# Altium schematic sheet Sheet2.SchDoc
size B; SheetNumber: 1; SheetTotal: 1
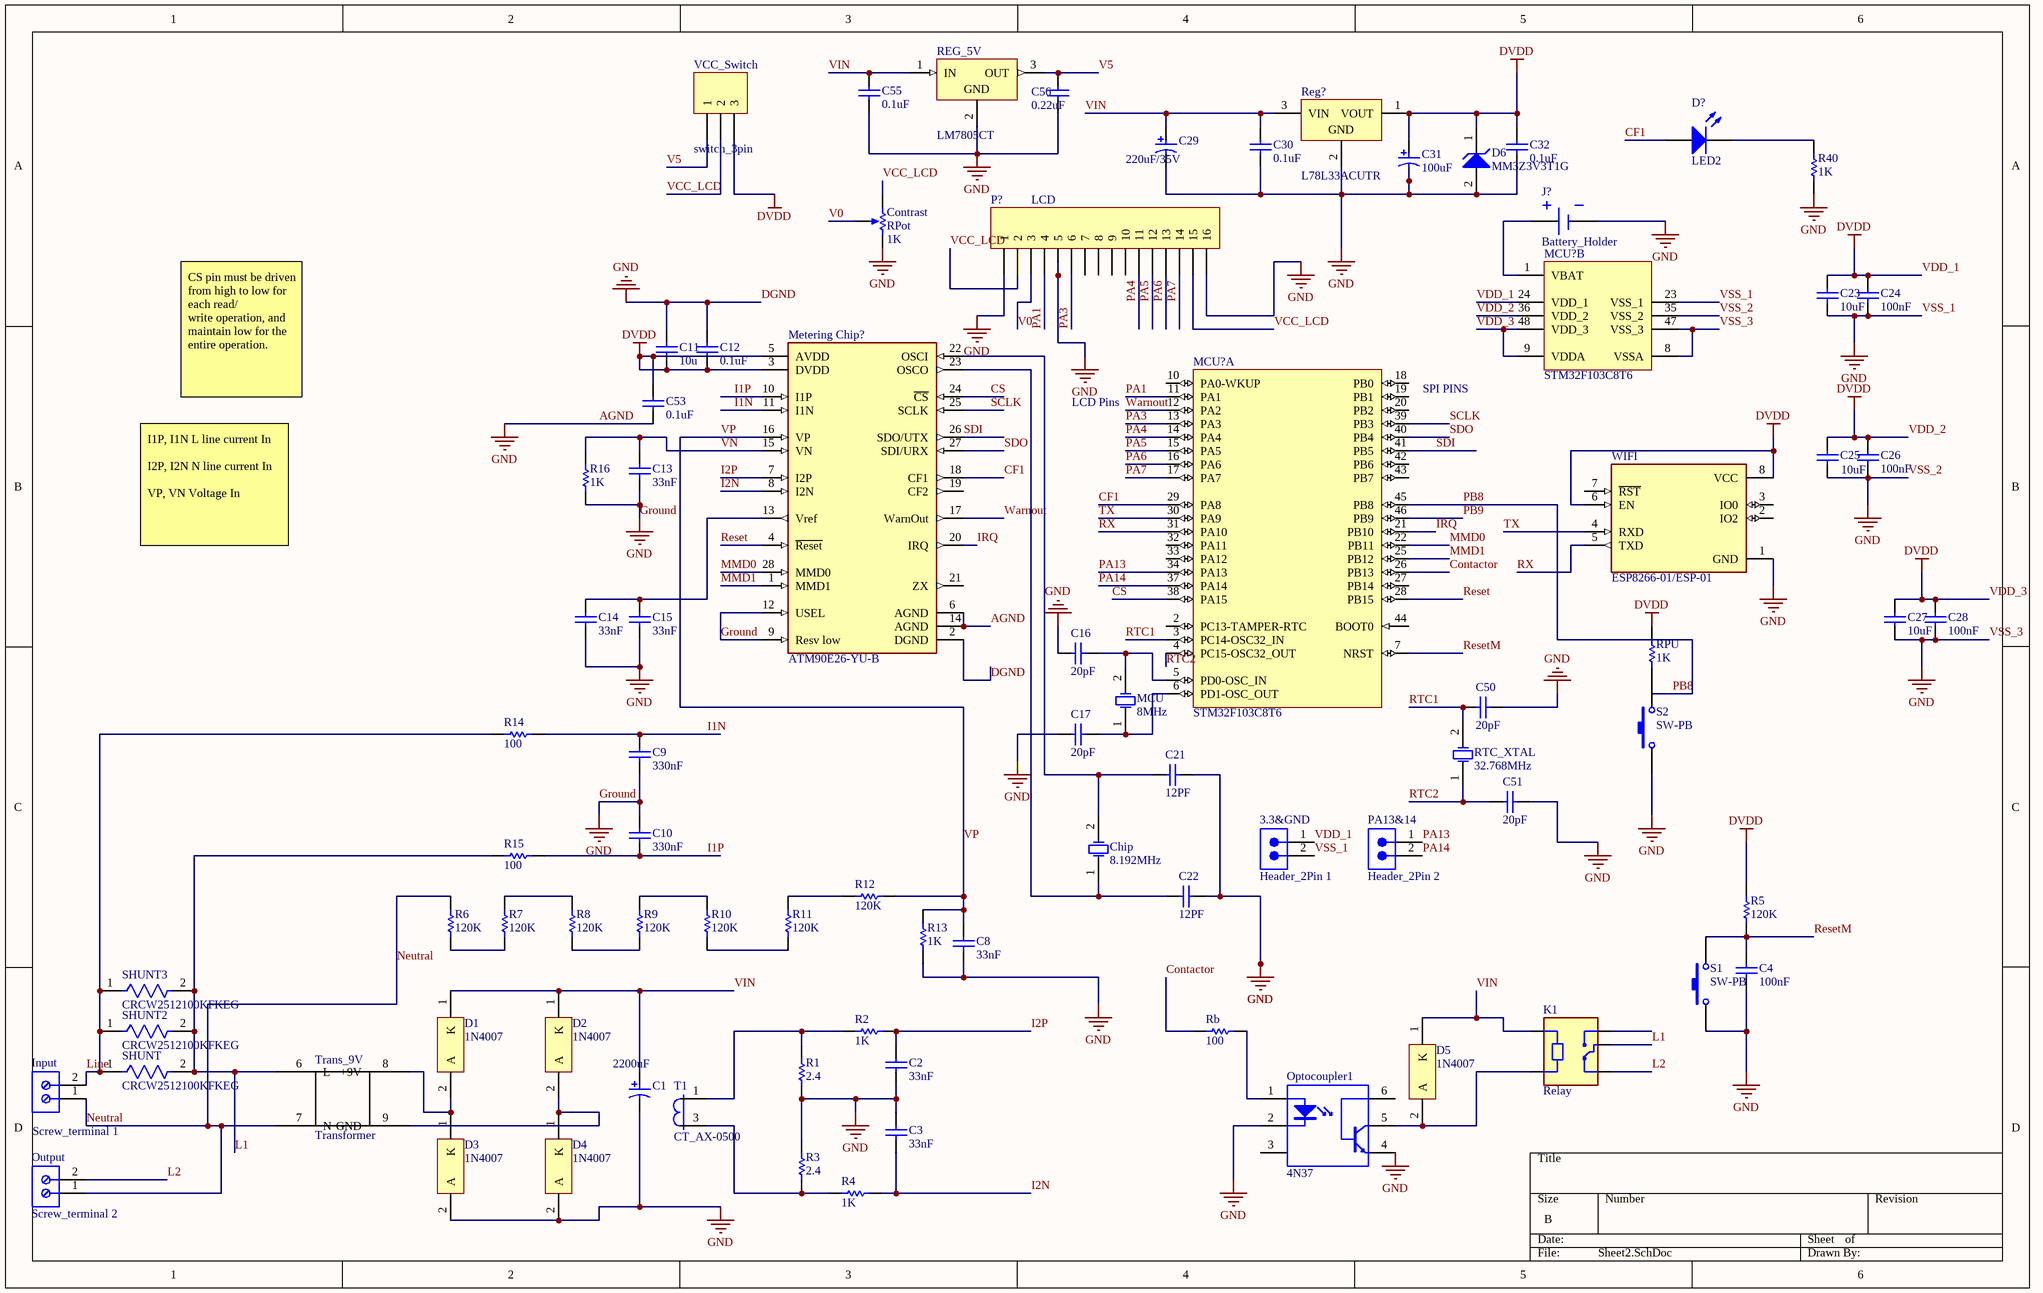
[diagram p0: Sheet2.SchDoc]

## Parts
(Parts that share a designator on the sheet are numbered #1, #2 ... from top to bottom, then left to right.)
3.3&GND  Header_2Pin 1  [SMTC-TSW-102-08-X-S-RA]
C1  2200uF  [PNSC-EEV-FK1J471M_L]
C2  33nF  [CAPC2013X94X50ML20T25]
C3  33nF  [CAPC2013X94X50ML20T25]
C4  100nF  [CAPC2013X94X50ML20T25]
C8  33nF  [CAPC2013X94X50ML20T25]
C9  330nF  [CAPC2013X94X50ML20T25]
C10  330nF  [CAPC2013X94X50ML20T25]
C11  10u  [CAPC2013X94X50ML20T25]
C12  0.1uF  [CAPC2013X94X50ML20T25]
C13  33nF  [CAPC2013X94X50ML20T25]
C14  33nF  [CAPC2013X94X50ML20T25]
C15  33nF  [CAPC2013X94X50ML20T25]
C16  20pF  [CAPC2013X94X50ML20T25]
C17  20pF  [CAPC2013X94X50ML20T25]
C21  12PF  [CAPC2013X94X50ML20T25]
C22  12PF  [CAPC2013X94X50ML20T25]
C23  10uF  [CAPC2013X94X50ML20T25]
C24  100nF  [CAPC2013X94X50ML20T25]
C25  10uF  [CAPC2013X94X50ML20T25]
C26  100nF  [CAPC2013X94X50ML20T25]
C27  10uF  [CAPC2013X94X50ML20T25]
C28  100nF  [CAPC2013X94X50ML20T25]
C29  220uF/35V  [PNSC-EEE-TG1V221UP_L]
C30  0.1uF  [CAPC2013X94X50ML20T25]
C31  100uF  [PNSC-EEE-TG1V221UP_L]
C32  0.1uF  [CAPC2013X94X50ML20T25]
C50  20pF  [CAPC2013X94X50ML20T25]
C51  20pF  [CAPC2013X94X50ML20T25]
C53  0.1uF  [CAPC2013X94X50ML20T25]
C55  0.1uF  [CAPC2013X94X50ML20T25]
C56  0.22uF  [CAPC2013X94X50ML20T25]
Chip  8.192MHz  [R38]
Contrast  RPot  value 1K  [VR5]
D1  1N4007  [ONSC-AXIAL_LEAD-2-59-10_P]
D2  1N4007  [ONSC-AXIAL_LEAD-2-59-10_P]
D3  1N4007  [ONSC-AXIAL_LEAD-2-59-10_P]
D4  1N4007  [ONSC-AXIAL_LEAD-2-59-10_P]
D5  1N4007  [ONSC-AXIAL_LEAD-2-59-10_P]
D6  MM3Z3V3T1G  [ONSC-SOD-323-2-477-02_V]
D?  LED2  [3.2X1.6X1.1]
Input  Screw_terminal 1  [PHOE-1714955_V]
J?  Battery_Holder  [KEYSTONE-1025-7-2_V]
K1  Relay  [RELAY_SRD-05VDC-SL-C]
MCU  8MHz  [R38]
MCU?#1  STM32F103C8T6  [STM-LQFP48_L]  (part B of 2)
MCU?#2  STM32F103C8T6  [STM-LQFP48_L]  (part A of 2)
Metering_Chip?  ATM90E26-YU-B  [FP-28Y-IPC_C]
Optocoupler1  4N37  [LTST-DIP-6_A]
Output  Screw_terminal 2  [PHOE-1714955_V]
P?  LCD  [HDR1X16]
PA13&14  Header_2Pin 2  [SMTC-TSW-102-08-X-S-RA]
R1  2.4  [RESC2013X50X30ML20T20]
R2  1K  [RESC2013X50X30ML20T20]
R3  2.4  [RESC2013X50X30ML20T20]
R4  1K  [RESC2013X50X30ML20T20]
R5  120K  [RESC2013X50X30ML20T20]
R6  120K  [RESC2013X50X30ML20T20]
R7  120K  [RESC2013X50X30ML20T20]
R8  120K  [RESC2013X50X30ML20T20]
R9  120K  [RESC2013X50X30ML20T20]
R10  120K  [RESC2013X50X30ML20T20]
R11  120K  [RESC2013X50X30ML20T20]
R12  120K  [RESC2013X50X30ML20T20]
R13  1K  [RESC2013X50X30ML20T20]
R14  100  [RESC2013X50X30ML20T20]
R15  100  [RESC2013X50X30ML20T20]
R16  1K  [RESC2013X50X30ML20T20]
R40  1K  [RESC2013X50X30ML20T20]
Rb  100  [RESC2013X50X30ML20T20]
Reg?  L78L33ACUTR  [SOT-89_L]
REG_5V  LM7805CT  [FAIR-TO-220-3]
RPU  1K  [RESC2013X50X30ML20T20]
RTC_XTAL  32.768MHz  [R38]
S1  SW-PB  [SPST-2]
S2  SW-PB  [SPST-2]
SHUNT  CRCW2512100KFKEG  [FP-CRCW2512-e3-MFG]
SHUNT2  CRCW2512100KFKEG  [FP-CRCW2512-e3-MFG]
SHUNT3  CRCW2512100KFKEG  [FP-CRCW2512-e3-MFG]
T1  CT_AX-0500  [INDRR1270W55L1720T953H2040_AX-0500]
Trans_9V  Transformer  [PCBComponent_1]
VCC_Switch  switch_3pin  [HDR1X3H]
WIFI  ESP8266-01/ESP-01  [XCVR_ESP8266-01/ESP-01]

## Nets
AGND: 3.3&GND.2 C1.2 C2.2 C3.1 C4.2 C8.2 C9.2 C10.1 C11.1 C12.1 C13.2 C14.2 C15.2 C16.1 C17.2 C21.1 C22.1 C23.2 C24.2 C25.2 C26.2 C27.2 C28.2 C29.2 C30.1 C31.2 C32.1 C50.2 C51.2 C53.2 C55.1 C56.1 Contrast.2(BOT) D3.2(A) D4.2(A) D6.2(A) J?.2(-) MCU?#1.8(VSSA) MCU?#1.23(VSS_1) MCU?#1.35(VSS_2) MCU?#1.47(VSS_3) Metering_Chip?.2(DGND) Metering_Chip?.6(AGND) Metering_Chip?.9(Resv_low) Metering_Chip?.12(USEL) Metering_Chip?.14(AGND) Optocoupler1.2(C) Optocoupler1.4(E) P?.1 P?.5 P?.16 R1.1 R3.2 R13.1 R16.1 R40.1 Reg?.2(GND) REG_5V.2(GND) S1.1 S2.1 WIFI.1(GND)  [also labelled DGND, GND, Ground, VSS_1, VSS_2, VSS_3]
VDD_1: 3.3&GND.1 C11.2 C12.2 C23.1 C24.1 C25.1 C26.1 C27.1 C28.1 C31.1 C32.2 C53.1 D6.1(K) MCU?#1.9(VDDA) MCU?#1.24(VDD_1) MCU?#1.36(VDD_2) MCU?#1.48(VDD_3) Metering_Chip?.3(DVDD) Metering_Chip?.5(AVDD) R5.2 Reg?.1(VOUT) RPU.2 VCC_Switch.3 WIFI.6(EN) WIFI.8(VCC)  [also labelled DVDD, VDD_2, VDD_3]
CF1: D?.1(A) MCU?#2.29(PA8) Metering_Chip?.18(CF1)
Contactor: MCU?#2.26(PB13) Rb.2
CS: MCU?#2.38(PA15) Metering_Chip?.24(~{CS})
I1N: C9.1 Metering_Chip?.11(I1N) R14.2
I1P: C10.2 Metering_Chip?.10(I1P) R15.2
I2N: C3.2 Metering_Chip?.8(I2N) R4.1
I2P: C2.1 Metering_Chip?.7(I2P) R2.1
IRQ: MCU?#2.21(PB10) Metering_Chip?.20(IRQ)
L1: K1.COM R15.1 SHUNT.2 SHUNT2.2 SHUNT3.2 Trans_9V.6(L)
L2: K1.NC Output.2
Line: Input.2 R14.1 SHUNT.1 SHUNT2.1 SHUNT3.1
MMD0: MCU?#2.22(PB11) Metering_Chip?.28(MMD0)
MMD1: MCU?#2.25(PB12) Metering_Chip?.1(MMD1)
Neutral: Input.1 Output.1 R6.2 Trans_9V.7(N)
PA1: MCU?#2.11(PA1) P?.4
PA3: MCU?#2.13(PA3) P?.6
PA4: MCU?#2.14(PA4) P?.11
PA5: MCU?#2.15(PA5) P?.12
PA6: MCU?#2.16(PA6) P?.13
PA7: MCU?#2.17(PA7) P?.14
PA13: MCU?#2.34(PA13) PA13&14.1
PA14: MCU?#2.37(PA14) PA13&14.2
PB8: MCU?#2.45(PB8)
PB9: MCU?#2.46(PB9)
Reset: MCU?#2.28(PB15) Metering_Chip?.4(~{Reset})
ResetM: C4.1 MCU?#2.7(NRST) R5.1 S1.2
RTC1: C50.1 MCU?#2.3(PC14-OSC32_IN) RTC_XTAL.2(OSC2)
RTC2: C51.1 MCU?#2.4(PC15-OSC32_OUT) RTC_XTAL.1(OSC1)
RX: MCU?#2.31(PA10) WIFI.5(TXD)
SCLK: MCU?#2.39(PB3) Metering_Chip?.25(SCLK)
SDI: MCU?#2.41(PB5) Metering_Chip?.26(SDO/UTX)
SDO: MCU?#2.40(PB4) Metering_Chip?.27(SDI/URX)
TX: MCU?#2.30(PA9) WIFI.4(RXD)
V0: Contrast.3(TAP) P?.3
V5: C56.2 REG_5V.3(OUT) VCC_Switch.1
VCC_LCD: Contrast.1(TOP) P?.2 P?.15 VCC_Switch.2
VIN: C1.1 C29.1 C30.2 C55.2 D1.1(K) D2.1(K) D5.1(K) K1.A1 Reg?.3(VIN) REG_5V.1(IN)
VN: C13.1 Metering_Chip?.15(VN) R16.2
VP: C8.1 Metering_Chip?.16(VP) R12.2 R13.2
Warnout: MCU?#2.12(PA2) Metering_Chip?.17(WarnOut)
NetC14_1: C14.1 C15.1 Metering_Chip?.13(Vref)
NetC16_2: C16.2 MCU.2(OSC2) MCU?#2.5(PD0-OSC_IN)
NetC17_1: C17.1 MCU.1(OSC1) MCU?#2.6(PD1-OSC_OUT)
NetC21_2: C21.2 Chip.2(OSC2) Metering_Chip?.22(OSCI)
NetC22_2: C22.2 Chip.1(OSC1) Metering_Chip?.23(OSCO)
NetD1_2: D1.2(A) D3.1(K) Trans_9V.8(+9V)
NetD2_2: D2.2(A) D4.1(K) Trans_9V.9(GND)
NetD5_2: D5.2(A) K1.A2 Optocoupler1.5(C)
NetD?_2: D?.2(K) R40.2
NetJ?_1: J?.1(+) MCU?#1.1(VBAT)
NetOptocoupler1_1: Optocoupler1.1(A) Rb.1
NetR1_2: R1.2 R2.2 T1.1
NetR3_1: R3.1 R4.2 T1.3
NetR6_1: R6.1 R7.1
NetR7_2: R7.2 R8.2
NetR8_1: R8.1 R9.1
NetR9_2: R9.2 R10.2
NetR10_1: R10.1 R11.1
NetR11_2: R11.2 R12.1
NetRPU_1: RPU.1 S2.2

Not connected (* = marked no-connect by the designer): K1 NO; MCU?#2 2(PC13-TAMPER-RTC) 10(PA0-WKUP) 18(PB0) 19(PB1) 20(PB2) 27(PB14) 32(PA11) 33(PA12) 42(PB6) 43(PB7) 44(BOOT0); Metering_Chip? 19(CF2) 21(ZX); Optocoupler1 3(NC) 6(B); P? 7 8 9 10; WIFI 2(IO2) 3(IO0) 7(~{RST})

## Notes on the sheet
- CS pin must be driven from high to low for each read/
  write operation, and maintain low for the entire operation.
- LCD Pins
- (near MCU?#2) SPI PINS
- I1P, I1N L line current In
  I2P, I2N N line current In
  VP, VN Voltage In

## Library data of the parts
3.3&GND PA13&14 = CMP-1024-00319-1: 0.025" SQ Post Header, Through-hole, Right Angle, -55 to 105 degC, 2.54 mm Pitch, 2-Pin, Male, RoHS; Manufacturer: Samtec; PartNumber: TSW-102-08-T-S-RA; Pitch: 2.54 mm; ComponentLink1Description: Manufacturer URL; ComponentLink1URL: http://www.samtec.com; ComponentLink2Description: Datasheet; ComponentLink2URL: http://www.samtec.com/documents/webfiles/pdf/TSW_TH.PDF; Mounting Technology: Through-hole; Temperature Range: -55 to 105 degC; PackageDescription: .025[0.64] SQ. Post Terminal Strip Assembly; PackageVersion: DM, 8/1988; Orientation: Right Angle; ComponentLink3URL: http://www.samtec.com/documents/webfiles/cpdf/TSW-XXX-XX-XXX-X-XX-XXX-MKT.pdf; RoHS: True; ComponentLink3Description: Package Specification; DatasheetVersion: F-214; PackageReference: TSW-102-08-X-S-RA
C1 = CMP-1665-00018-3: Aluminum Electrolytic Capacitor (SMD Type), 470 uF, 63 V, -55 to 105 degC, 2-Pin CAPAE, RoHS, Tape and Reel; Manufacturer: Panasonic; Voltage Rating: 63 V; Mounting Technology: Surface Mount; Length: 17 mm; PackageDescription: 2-Pin Electrolytic Aluminum Capacitor, Body 17 x 17 mm; Package Quantity: 125; ComponentLink1URL: http://www.panasonic.com/; RoHSCompliant: true; REACH SVHC: Unknown; Pins: 2; DatasheetVersion: 03/2016; PackageReference: EEV-FK1J471M; Min Operating Temperature: -55 degC; ComponentLink2URL: https://industrial.panasonic.com/cdbs/www-data/pdf/RDE0000/ABA0000C1181.pdf; Height: 16.5 mm; ComponentLink2Description: Datasheet; ComponentLink1Description: Manufacturer URL; Mount: Surface Mount; Packaging: Tape and Reel; Max Operating Temperature: 105 degC
C2-C4 C8-C17 C21-C28 C30 C32 C50 C51 C53 C55 C56 = CMP-2007-04307-1: Manufacturer: AVX Interconnect / Elco; Part Number: 08055A271FAT2A
C29 C31 = CMP-2000-06220-1: Aluminum Electrolytic Capacitor, 220 uF, 20%, 35 V, -40 to 125 degC, 2-Pin SMD, RoHS, Tape and Reel; Manufacturer: Panasonic; Type: Can; Lifetime@Temperature: 2000Hrs@125°C; ESR (Equivalent Series Resistance): 0.3O; Capacitance: 220µF; Ripple Current: 270mA; Rated Voltage: 35V; Datasheet Version: 09/2011; Manufacturer URL: http://www.panasonic.com/; Operating Temp Range: -40to+125°C; Series: TG; Mounting Technology: SurfaceMount; Package Description: 2-Pin Surface Mount Device, Body 10.3 x 10.3 mm; Package Reference: EEE-TG1V221UP; Datasheet URL: http://datasheet.octopart.com/EEE-TG1V221UP-Panasonic---ECG-datasheet-10851968.pdf; Operating Temp-Max: 125°C; Case Size/Dimension: Ø10x10.2mm
Chip MCU RTC_XTAL = XTAL: Crystal Oscillator; Published: 8-Jun-2000; LatestRevisionDate: 17-Jul-2002; LatestRevisionNote: Re-released for DXP Platform.; PackageReference: R38; Publisher: Altium Limited; PackageDescription: Crystal, Thru-Hole; 2 Leads; Body 3.1 x 8.2 mm (Dia.xH)
Contrast = RPot: Potentiometer; Sim Note: Enter the Resistance value and the set point into parameter fields.; Set Position: 0.5; Published: 8-Jun-2000; LatestRevisionDate: 17-Jul-2002; LatestRevisionNote: Re-released for DXP Platform.; PackageReference: VR5; Publisher: Altium Limited; PackageDescription: Variable Resistor, Thru-Hole; 3 Leads
D1-D5 = CMP-0902-00142-1: Standard Recovery Rectifier, 2-Pin Axial_Lead, Pb-Free, Bulk Bag; Manufacturer: On Semiconductor; IO(rec) Max (A): 1; IFSM Max (A): 30; VRRM Max (V): 1000; ComponentLink3URL: http://www.onsemi.cn/pub_link/Collateral/59-10.PDF; PackageVersion: Rev. U, 02/2005; PackageDescription: 2-Pin, Axial Lead, Diameter 2.35 mm; PackageReference: AXIAL_LEAD-2-59-10; RoHS: TRUE; PartNumber: 1N4007; Packing: Bulk Bag; DatasheetVersion: Rev. 13; ComponentLink3Description: Package Specification; ComponentLink1Description: Manufacturer URL; ComponentLink2URL: http://www.onsemi.com/pub_link/Collateral/1N4001-D.PDF; ComponentLink1URL: http://www.onsemi.com/; Type: Standard Recovery; ComponentLink2Description: Datasheet; Mounting Technology: Through Hole
D6 = CMP-1060-00672-1: Zener Voltage Regulator, 300 mW, 2-Pin SOD-323, Pb-Free, Tape and Reel; Manufacturer: On Semiconductor; VZ Typ (V): 3.3; P Max (W): 0.3; ComponentLink1URL: http://www.onsemi.com/; ComponentLink2Description: Datasheet; PackageVersion: Rev. H, 03/2007; PartNumber: MM3Z3V3T1G; PackageReference: SOD-323-2-477-02; ComponentLink1Description: Manufacturer URL; PackageDescription: 2-Pin SOD, Body 1.7 x 1.25 mm; RoHS: Pb-Free; ComponentLink3Description: Package Specification; Packing: Tape and Reel; DatasheetVersion: Rev. 9; ComponentLink3URL: http://www.onsemi.com/pub_link/Collateral/477-02.PDF.1; Mounting Technology: Surface Mount; ComponentLink2URL: http://www.onsemi.cn/pub_link/Collateral/MM3Z2V4T1-D.PDF
D? = LED2: Typical RED, GREEN, YELLOW, AMBER GaAs LED; Published: 8-Jun-2000; LatestRevisionDate: 17-Jul-2002; LatestRevisionNote: Re-released for DXP Platform.; PackageVersion: Feb-2002; PackageReference: 3.2X1.6X1.1; Publisher: Altium Limited; PackageDescription: SM LED; 2 Flat Leads
Input Output = CMP-2000-05797-1: PC Terminal Block, Pitch 6.35 mm, 1 x 2 Position, Height 21.5 mm, Tail Lenght 5.1 mm, RoHS, Bulk; Manufacturer: Phoenix Contact; Package Description: PC Terminal Block, Pitch 6.35 mm, 1 x 2 Position, Height 21.5 mm, Tail Lenght 5.1 mm; Datasheet URL: http://media.digikey.com/pdf/Data%20Sheets/Phoenix%20Contact%20PDFs/1714955.pdf; Package Reference: 1714955; Manufacturer URL: http://www.phoenixcontact.com/; Datasheet Version: 02/2010; Mounting Technology: ThroughHole
J? = CMP-0465-00001-2: Holder for 2477 or 2430 Cells P/N 1025-7, Body 27.762 x 30.963 mm, THM; Manufacturer: Keystone; # of Cells: 1; Cell Size: 24 mm; ComponentLink1Description: Manufacturer URL; PackageDescription: 2-Pin Hand Drawn, Body 27.762 x 30.963 mm; Material: Plastic; ComponentLink1URL: http://www.keyelco.com/; Type: HOLDER; ComponentLink2URL: http://www.keyelco.com/product-pdf.cfm?p=3950; Switch Current Limit (Typ) (A): 1; PartNumber: 1025-7; ComponentLink2Description: Datasheet; PackageReference: KEYSTONE-1025-7-2; DatasheetVersion: Rev.C; Mounting Technology: Through Hole
K1 = SRD-05VDC-SL-C: 5V Trigger Relay Module For Arduino And Raspberry Pi 5V Trigger Relay Module For Arduino And Raspberry Pi; MF: Songle Relay; Package: None; Value: *; Availability: Not in stock; SnapEDA_Link: https://www.snapeda.com/parts/SRD-05VDC-SL-C/Songle+Relay/view-part/?ref=snap; Price: None; MP: SRD-05VDC-SL-C; Check_prices: https://www.snapeda.com/parts/SRD-05VDC-SL-C/Songle+Relay/view-part/?ref=eda
MCU?#1 MCU?#2 = CMP-0237-00215-3: ARM Cortex-M3 32-bit MCU, 64 KB Flash, 20 KB Internal RAM, 37 I/Os, 48-pin LQFP, -40 to 85 degC, Tray; Supply Voltage(Vcc) min (V): 2; Internal RAM Size (kB): 20; FLASH Size (Prog) (kB): 64; A/D Converter: 2x12-bit (10 Channel); I/Os (High Current): 37; Operating Frequency(F) (Processor speed) (MHz): 72; Core: ARM Cortex-M3; ComponentLink3Description: Package Specification; Mounting Technology: Surface Mount; PartNumber: STM32F103C8T6; PackageReference: LQFP48; Packing: Tray; ComponentLink3URL: http://www.st.com/st-web-ui/static/active/en/resource/technical/document/datasheet/DM00058181.pdf; DatasheetVersion: Rev. 16; ComponentLink1URL: http://www.st.com/web/en/home.html; PackageVersion: Rev. 6, 06/2013; ComponentLink2URL: http://www.st.com/st-web-ui/static/active/en/resource/technical/document/datasheet/CD00161566.pdf; ComponentLink1Description: Manufacturer URL; ComponentLink2Description: Datasheet; PackageDescription: 48-Pin Low Profile Quad Flat Package, 7 x 7 mm Body, 0.5 mm Pitch
Metering_Chip? = CMP-06317-000007-1: IC ENERGY METER 1.8V/3V 28SSOP; RoHS Compliant: Yes; Case/Package: SSOP; Packaging: Bulk; Max Operating Temperature: 85°C; Min Operating Temperature: -40°C; Mount: Surface Mount
Optocoupler1 = CMP-2000-05615-1: Photocoupler - Phototransistor Output, 1500 Vrms, -55 to 100 degC, 6-Pin DIP, RoHS, Tube; Manufacturer: Vishay; Maximum Input Diode Current: 60mA; Output Type: DC; Maximum Collector Current: 100mA; Isolation Voltage: 5000Vrms; Maximum Power Dissipation: 70mW; Maximum Reverse Diode Voltage: 6V; Current Transfer Ratio: 50%; Number of Channels: 1Channel; Output Device: NPNPhototransistor; Brand: VishaySemiconductors; Maximum Forward Diode Voltage: 1.5V; Maximum Collector Emitter Voltage: 30V; RoHS: Details; Package Description: 6-Pin Double In-line Package, Body 7.3 x 6.5 mm, Pitch 2.54 mm; Product Category: TransistorOutputOptocouplers; Packaging: Tube; Manufacturer URL: http://www.us.liteon.com/; Minimum Operating Temperature: -55C; Package Reference: DIP-6; Input Type: DC; Datasheet Version: Rev. D, 12/2015; Datasheet URL: http://optoelectronics.liteon.com/upload/download/DS-70-99-0012/S_110_4N3X%20Series%201115.pdf; Maximum Operating Temperature: +100C; Package / Case: PDIP-6; Forward Current: 60mA; Configuration: 1Channel; Factory Pack Quantity: 3000; Number of Channels per Chip: 1Channel; Mounting Technology: ThroughHole
P? = Header 16: Header, 16-Pin; LatestRevisionDate: 17-Jul-2002; LatestRevisionNote: Re-released for DXP Platform.; Publisher: Altium Limited
R1-R16 R40 Rb RPU = CMP-1013-00031-2: Part Number: CRCW080516R0JNEA; Manufacturer: Vishay Dale
Reg? = CMP-0244-00409-1: Positive Voltage Regulator, 3.3V, 4-Pin SOT-89, Tape and Reel; ComponentLink1Description: Manufacturer URL; ComponentLink2URL: http://www.st.com/internet/com/TECHNICAL_RESOURCES/TECHNICAL_LITERATURE/DATASHEET/CD00000446.pdf; DatasheetVersion: 1/02/2011; PackageReference: SOT-89; PackageDescription: 3-Pin SOT-89 Package 1.5 mm Pitch, 4.1 mm Lead Span; ComponentLink1URL: http://www.st.com; ComponentLink2Description: Datasheet; PackageVersion: 2011
REG_5V = CMP-2000-04938-1: Positive Voltage Regulator, 5 V, 1 A, -40 to 125 degC, 3-Pin TO-220, RoHS, Tube; Manufacturer: FairchildSemiconductor; Maximum Input Voltage: 35V; Maximum Quiescent Current: 8mA; Load Regulation: 100mV; Maximum Output Current: 2.2(Typ)A; Output Type: Fixed; Typical Dropout Voltage @ Current: 2@1AV; Rad Hard: No; Output Voltage: 5V; Accuracy: ±4%; Number of Outputs: 1; Category: LinearRegulator; Package Description: 3-Pin Through Hole Device, Body 10 x 4.5 mm, Pitch 2.54 mm; Packaging: Rail/Tube; Mounting: ThroughHole; Polarity: Positive; Manufacturer URL: https://www.fairchildsemi.com/; Line Regulation: 100mV; Datasheet Version: Aug-12; Datasheet URL: https://datasheet.ciiva.com/26904/lm7805ct-26904988.pdf; Package Reference: TO-220; Package URL: https://www.fairchildsemi.com/package-drawings/TO/TO220B03.pdf; Package: 3TO-220AB; Operating Temperature: -40to125degC; Type: Linear
S1 S2 = SW-PB: Switch; Published: 24-Mar-1999; LatestRevisionDate: 17-Jul-2002; LatestRevisionNote: Re-released for DXP Platform.; PackageReference: SPST-2; Publisher: Altium Limited; PackageDescription: Switch; 2 Leads
SHUNT SHUNT2 SHUNT3 = CMP-02407-004199-1: RES Thick Film, 100kΩ, 1%, 1W, 100ppm/°C, 2512; Voltage Rating: 500V; Resistance: 100kR; Case Code (Metric): 6432; Temperature Coefficient: 100ppm/°C; Weight: 0.001429oz; Radiation Hardening: No; Voltage Rating (DC): 500V; Case Code (Imperial): 2512; Length: 6.3mm; Number of Pins: 2; Military Standard: Not; Packaging: Tape and Reel; Contact Plating: Tin; Width: 3.15mm; Lead Free: Lead Free; Package Quantity: 2000; Composition: Thick Film; Termination: SMD/SMT; Number of Terminations: 2; Features: Automotive AEC-Q200; Max Power Dissipation: 1W; Case/Package: 2512; Min Operating Temperature: -55°C; Depth: 3.15mm; Max Operating Temperature: 155°C; Tolerance: 1%; Power Rating: 1W; Height: 0.6mm
T1 = AX-0500: 5A Current Sense Transformer 50Hz ~ 60Hz Through Hole; MF: Talema Group LLC; Package: Talema Group LLC; Price: None; Value: *; MP: AX-0500; SnapEDA_Link: https://www.snapeda.com/parts/AX-0500/Talema%20Group%20LLC/view-part/3208690/?ref=snap; Availability: Unavailable
Trans_9V = Component_1
VCC_Switch = Header 3H: Header, 3-Pin, Right Angle; LatestRevisionDate: 17-Jul-2002; LatestRevisionNote: Re-released for DXP Platform.; Publisher: Altium Limited
WIFI = ESP8266-01/ESP-01: MakerFocus 4pcs ESP8266 ESP-01 Serial Wireless WiFi Transceiver Receiver Module 1MB SPI Flash DC3.0-3.6V Internet of Things WiFi Module Board Compatible with Ar duino; MF: AI-Thinker; SnapEDA_Link: https://www.snapeda.com/parts/ESP8266-01/ESP-01/AI-Thinker/view-part/?ref=snap; Availability: Not in stock; Price: None; Package: Non-Standard AI-Thinker; Check_prices: https://www.snapeda.com/parts/ESP8266-01/ESP-01/AI-Thinker/view-part/?ref=eda; Value: *; MP: ESP8266-01/ESP-01